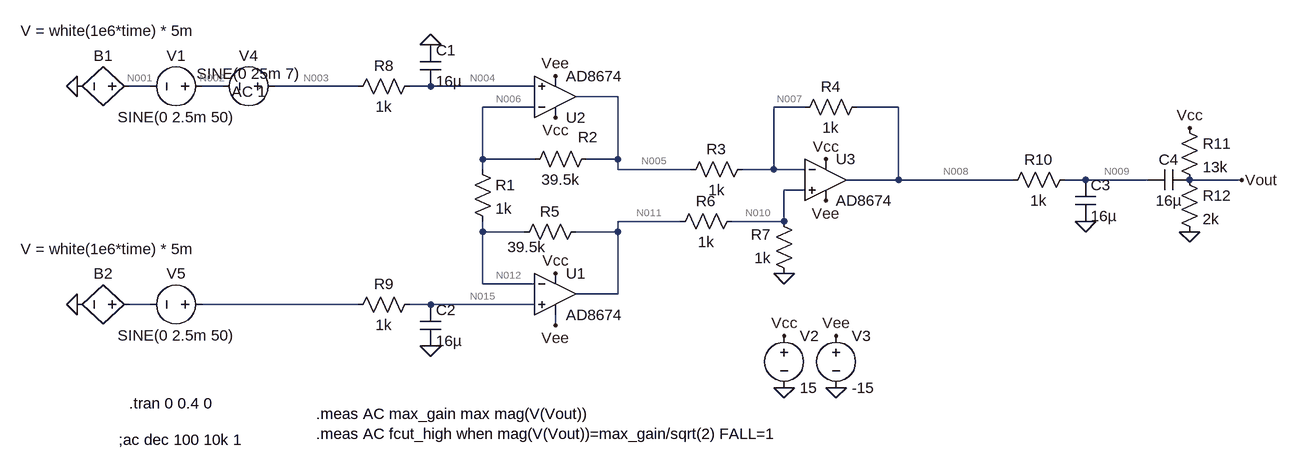
[diagram p0: schematic Final Signal Conditioning Circuit.asc]
Final Signal Conditioning Circuit.asc, the LTspice schematic file:
Version 4
SHEET 1 1844 680
WIRE -432 -32 -464 -32
WIRE -320 -32 -352 -32
WIRE -112 -32 -240 -32
WIRE 0 -32 -32 -32
WIRE 160 -32 0 -32
WIRE 288 -16 224 -16
WIRE 160 0 80 0
WIRE 576 0 528 0
WIRE 720 0 656 0
WIRE 80 80 80 0
WIRE 160 80 80 80
WIRE 288 80 288 -16
WIRE 288 80 240 80
WIRE 80 96 80 80
WIRE 288 96 288 80
WIRE 400 96 288 96
WIRE 528 96 528 0
WIRE 528 96 480 96
WIRE 576 96 528 96
WIRE 720 112 720 0
WIRE 720 112 640 112
WIRE 896 112 720 112
WIRE 1008 112 976 112
WIRE 1104 112 1008 112
WIRE 1248 112 1168 112
WIRE 576 128 544 128
WIRE 384 176 288 176
WIRE 544 176 544 128
WIRE 544 176 464 176
WIRE 80 192 80 176
WIRE 144 192 80 192
WIRE 288 192 288 176
WIRE 288 192 224 192
WIRE 80 272 80 192
WIRE 160 272 80 272
WIRE 288 288 288 192
WIRE 288 288 224 288
WIRE -432 304 -464 304
WIRE -112 304 -352 304
WIRE 0 304 -32 304
WIRE 160 304 0 304
WIRE 192 336 192 320
FLAG 544 256 0
FLAG 544 432 0
FLAG 624 432 0
FLAG 544 352 Vcc
FLAG 192 16 Vcc
FLAG 192 256 Vcc
FLAG 608 80 Vcc
FLAG 624 352 Vee
FLAG 192 -48 Vee
FLAG 192 336 Vee
FLAG 608 144 Vee
FLAG 0 -96 0
FLAG -544 -32 0
FLAG 0 368 0
FLAG -544 304 0
FLAG 1008 176 0
FLAG 1248 112 Vout
FLAG 1168 192 0
FLAG 1168 32 Vcc
SYMBOL OpAmps\\AD8674 192 224 R0
SYMATTR InstName U1
SYMBOL OpAmps\\AD8674 192 48 M180
SYMATTR InstName U2
SYMBOL OpAmps\\AD8674 608 48 R0
SYMATTR InstName U3
SYMBOL res 64 80 R0
SYMATTR InstName R1
SYMATTR Value 1k
SYMBOL res 256 64 R90
WINDOW 0 -2 14 VBottom 2
WINDOW 3 32 56 VTop 2
SYMATTR InstName R2
SYMATTR Value 39.5k
SYMBOL res 496 80 R90
WINDOW 0 0 56 VBottom 2
WINDOW 3 32 56 VTop 2
SYMATTR InstName R3
SYMATTR Value 1k
SYMBOL res 672 -16 R90
WINDOW 0 0 56 VBottom 2
WINDOW 3 32 56 VTop 2
SYMATTR InstName R4
SYMATTR Value 1k
SYMBOL res 240 176 R90
WINDOW 0 0 56 VBottom 2
WINDOW 3 24 92 VTop 2
SYMATTR InstName R5
SYMATTR Value 39.5k
SYMBOL res 480 160 R90
WINDOW 0 0 56 VBottom 2
WINDOW 3 32 56 VTop 2
SYMATTR InstName R6
SYMATTR Value 1k
SYMBOL res 560 272 R180
WINDOW 0 36 76 Left 2
WINDOW 3 36 40 Left 2
SYMATTR InstName R7
SYMATTR Value 1k
SYMBOL voltage 544 336 R0
WINDOW 123 0 0 Left 0
WINDOW 39 0 0 Left 0
SYMATTR InstName V2
SYMATTR Value 15
SYMBOL voltage 624 336 R0
WINDOW 123 0 0 Left 0
WINDOW 39 0 0 Left 0
SYMATTR InstName V3
SYMATTR Value -15
SYMBOL res -16 -48 R90
WINDOW 0 0 56 VBottom 2
WINDOW 3 32 56 VTop 2
SYMATTR InstName R8
SYMATTR Value 1k
SYMBOL cap -16 -96 R0
SYMATTR InstName C1
SYMATTR Value 16µ
SYMBOL bv -448 -32 R90
WINDOW 0 -32 56 VBottom 2
WINDOW 3 -101 49 VTop 2
SYMATTR InstName B1
SYMATTR Value V = white(1e6*time) * 5m
SYMBOL voltage -336 -32 R90
WINDOW 0 -32 56 VBottom 2
WINDOW 3 32 56 VTop 2
WINDOW 123 0 0 Left 0
WINDOW 39 0 0 Left 0
SYMATTR InstName V1
SYMATTR Value SINE(0 2.5m 50)
SYMBOL voltage -224 -32 R90
WINDOW 0 -32 56 VBottom 2
WINDOW 3 -4 56 VBottom 2
WINDOW 123 24 56 VBottom 2
WINDOW 39 0 0 Left 0
SYMATTR InstName V4
SYMATTR Value SINE(0 25m 7)
SYMATTR Value2 AC 1
SYMBOL res -16 288 R90
WINDOW 0 0 56 VBottom 2
WINDOW 3 32 56 VTop 2
SYMATTR InstName R9
SYMATTR Value 1k
SYMBOL cap -16 304 R0
SYMATTR InstName C2
SYMATTR Value 16µ
SYMBOL bv -448 304 R90
WINDOW 0 -32 56 VBottom 2
WINDOW 3 -101 49 VTop 2
SYMATTR InstName B2
SYMATTR Value V = white(1e6*time) * 5m
SYMBOL voltage -336 304 R90
WINDOW 0 -32 56 VBottom 2
WINDOW 3 32 56 VTop 2
WINDOW 123 0 0 Left 0
WINDOW 39 0 0 Left 0
SYMATTR InstName V5
SYMATTR Value SINE(0 2.5m 50)
SYMBOL res 992 96 R90
WINDOW 0 0 56 VBottom 2
WINDOW 3 32 56 VTop 2
SYMATTR InstName R10
SYMATTR Value 1k
SYMBOL cap 992 112 R0
SYMATTR InstName C3
SYMATTR Value 16µ
SYMBOL cap 1168 96 R90
WINDOW 0 0 32 VBottom 2
WINDOW 3 32 32 VTop 2
SYMATTR InstName C4
SYMATTR Value 16µ
SYMBOL res 1152 16 R0
SYMATTR InstName R11
SYMATTR Value 13k
SYMBOL res 1152 96 R0
SYMATTR InstName R12
SYMATTR Value 2k
TEXT -464 456 Left 2 !.tran 0 0.4 0
TEXT -480 512 Left 2 !;ac dec 100 10k 1
TEXT -176 472 Left 2 !.meas AC max_gain max mag(V(Vout))\n.meas AC fcut_high when mag(V(Vout))=max_gain/sqrt(2) FALL=1

The netlist it stands for:
* Final Signal Conditioning Circuit.asc
XU1 N015 N012 Vcc Vee N011 AD8674  ; pins In+ In- V+ V- OUT
XU2 N004 N006 Vcc Vee N005 AD8674  ; pins In+ In- V+ V- OUT
XU3 N010 N007 Vcc Vee N008 AD8674  ; pins In+ In- V+ V- OUT
R1 N006 N012 1k
R2 N005 N006 39.5k
R3 N007 N005 1k
R4 N008 N007 1k
R5 N011 N012 39.5k
R6 N010 N011 1k
R7 0 N010 1k
V2 Vcc 0 15
V3 Vee 0 -15
R8 N004 N003 1k
C1 0 N004 16µ
B1 N001 0 V = white(1e6*time) * 5m
V1 N002 N001 SINE(0 2.5m 50)
V4 N003 N002 SINE(0 25m 7) AC 1
R9 N015 N014 1k
C2 N015 0 16µ
B2 N013 0 V = white(1e6*time) * 5m
V5 N014 N013 SINE(0 2.5m 50)
R10 N009 N008 1k
C3 N009 0 16µ
C4 Vout N009 16µ
R11 Vcc Vout 13k
R12 Vout 0 2k
.tran 0 0.4 0
;ac dec 100 10k 1
.meas AC max_gain max mag(V(Vout))
.meas AC fcut_high when mag(V(Vout))=max_gain/sqrt(2) FALL=1
.backanno
.end

* Results of the author's LTspice run, read from the files saved beside the schematic
* Operating Point, zero values left out:
*   V(vcc) = 15 V
*   V(n015) = -7.568 µV
*   V(n012) = -268 µV
*   V(vee) = -15 V
*   V(n011) = -206.1 µV
*   V(n004) = -7.568 µV
*   V(n006) = -268 µV
*   V(n005) = -206.1 µV
*   V(n010) = -106.8 µV
*   V(n007) = -367.2 µV
*   V(n008) = -526.8 µV
*   V(n009) = -526.8 µV
*   V(vout) = 2 V
*   I(B2) = -7.568 nA
*   I(B1) = -7.568 nA
*   I(R12) = 1 mA
*   I(R11) = 1 mA
*   I(R9) = -7.568 nA
*   I(R8) = -7.568 nA
*   I(R7) = 106.8 nA
*   I(R6) = 99.25 nA
*   I(R5) = 1.567 nA
*   I(R4) = -159.6 nA
*   I(R3) = -161.2 nA
*   I(R2) = 1.567 nA
*   I(V5) = -7.568 nA
*   I(V4) = -7.568 nA
*   I(V1) = -7.568 nA
*   I(V3) = 9.015 mA
*   I(V2) = -10.02 mA
*   Ix(u1:1) = 7.568 nA
*   Ix(u1:2) = 1.567 nA
*   Ix(u1:99) = 3.005 mA
*   Ix(u1:50) = -3.005 mA
*   Ix(u1:39) = 97.69 nA
*   Ix(u2:1) = 7.568 nA
*   Ix(u2:2) = 1.567 nA
*   Ix(u2:99) = 3.005 mA
*   Ix(u2:50) = -3.005 mA
*   Ix(u2:39) = -162.7 nA
*   Ix(u3:1) = 7.568 nA
*   Ix(u3:2) = 1.567 nA
*   Ix(u3:99) = 3.005 mA
*   Ix(u3:50) = -3.005 mA
*   Ix(u3:39) = 159.6 nA
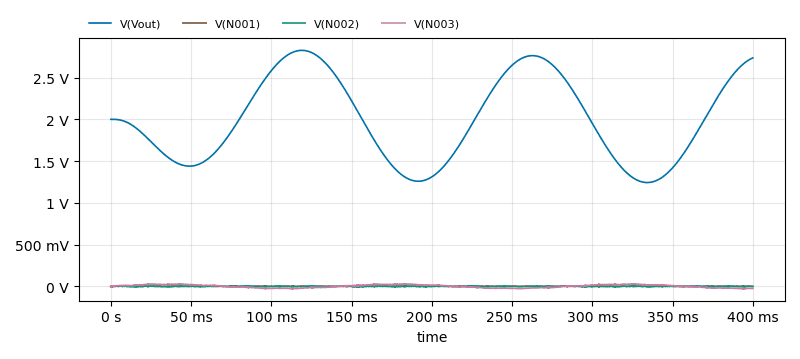
[diagram p1: Transient Analysis of Final Signal Conditioning Circuit.asc, plotted from the saved traces]
* Transient Analysis, 1 run:
*   V(Vout): min 1.243 V, max 2.826 V, average 1.989 V, rms 2.054 V, last 2.736 V
*   V(N001): min -2.479 mV, max 2.482 mV, average 40.39 µV, rms 1.234 mV, last -1.613 mV
*   V(N002): min -4.943 mV, max 4.903 mV, average 40.36 µV, rms 2.17 mV, last -1.613 mV
*   V(N003): min -29.6 mV, max 29.32 mV, average 1.022 mV, rms 18.1 mV, last -25.39 mV